# Altium schematic sheet PowerMeasurement.SchDoc
size A
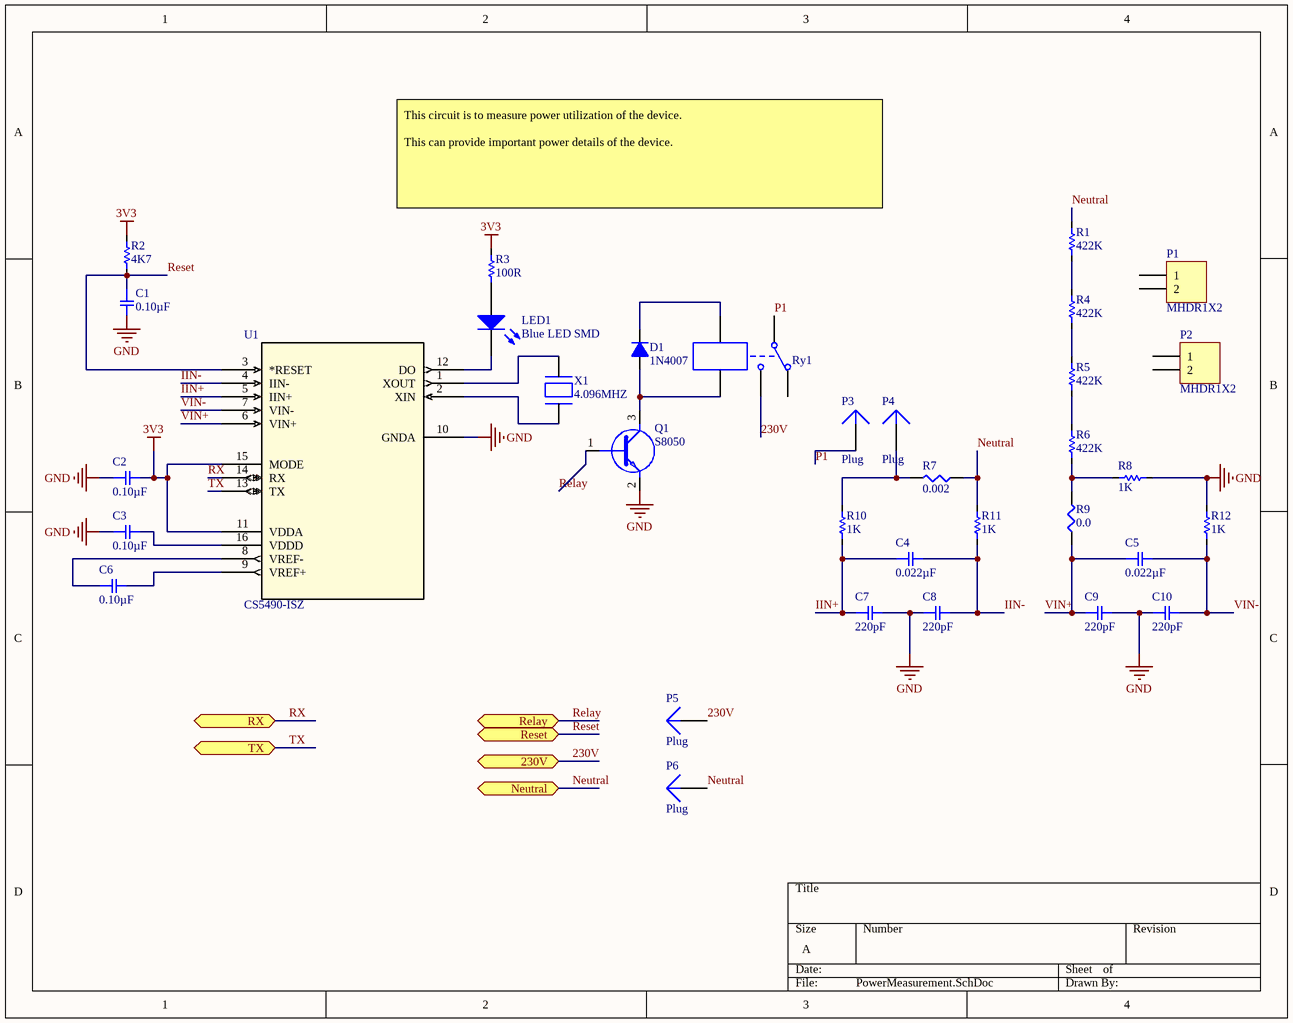
[diagram p0: PowerMeasurement.SchDoc]

## Parts
C1  0.10µF  [SMD-0402C]
C2  0.10µF  [SMD-0402C]
C3  0.10µF  [SMD-0402C]
C4  0.022µF  [SMD-0402C]
C5  0.022µF  [SMD-0402C]
C6  0.10µF  [SMD-0402C]
C7  220pF  [SMD-0402C]
C8  220pF  [SMD-0402C]
C9  220pF  [SMD-0402C]
C10  220pF  [SMD-0402C]
D1  1N4007  [D2A]
LED1  Blue LED SMD  [1206 Blue LED SMD]
P1  MHDR1X2  [MHDR1X2]
P2  MHDR1X2  [MHDR1X2]
P3  Plug  [PIN1]
P4  Plug  [PIN1]
P5  Plug  [PIN1]
P6  Plug  [PIN1]
Q1  S8050  [SI2305TP]
R1  422K  [MCS 0402]
R2  4K7  [MCS 0402]
R3  100R  [MCS 0402]
R4  422K  [MCS 0402]
R5  422K  [MCS 0402]
R6  422K  [MCS 0402]
R7  0.002  [SMD-2512-RES]
R8  1K  [MCS 0402]
R9  0.0  [SMD-0402-RES]
R10  1K  [MCS 0402]
R11  1K  [MCS 0402]
R12  1K  [MCS 0402]
Ry1  Relay  [SRD-05VDC-SL-C]  (value not drawn)
U1  CS5490-ISZ  [CIR-SOIC-16_W150]
X1  4.096MHZ  [XTAL_ABLS2-4.096MHZ-D4Y-T]

## Ports
230V (bidir), Neutral (bidir), Relay (bidir), Reset (bidir), RX (bidir), TX (bidir)

## Nets
3V3: C2.2 R2.2 R3.2 U1.11(VDDA) U1.15(MODE)
GND: C1.2 C2.1 C3.1 C7.2 C8.1 C9.2 C10.1 Q1.2(E) R8.1 R12.2 U1.10(GNDA)
230V: P5.1 Ry1.5 ; port 230V
IIN+: C4.1 C7.1 R10.1 U1.5(IIN+)
IIN-: C4.2 C8.2 R11.1 U1.4(IIN-)
Neutral: P6.1 R1.2 R7.1 R11.2 ; port Neutral
P1: P3.1 Ry1.4
Relay: Q1.1(B) ; port Relay
Reset: C1.1 R2.1 U1.3(*RESET) ; port Reset
RX: U1.14(RX) ; port RX
TX: U1.13(TX) ; port TX
VIN+: C5.1 C9.1 R9.1 U1.6(VIN+)
VIN-: C5.2 C10.2 R12.1 U1.7(VIN-)
NetC3_2: C3.2 U1.16(VDDD)
NetC6_1: C6.1 U1.8(VREF-)
NetC6_2: C6.2 U1.9(VREF+)
NetD1_1: D1.1(A) Q1.3(C) Ry1.2
NetD1_2: D1.2(K) Ry1.1
NetLED1_1: LED1.1(A) R3.1
NetLED1_2: LED1.2(K) U1.12(DO)
NetP4_1: P4.1 R7.2 R10.2
NetR1_1: R1.1 R4.2
NetR4_1: R4.1 R5.2
NetR5_1: R5.1 R6.2
NetR6_1: R6.1 R8.2 R9.2
NetU1_1: U1.1(XOUT) X1.2
NetU1_2: U1.2(XIN) X1.1

Not connected (* = marked no-connect by the designer): P1 1 2; P2 1 2; Ry1 3

## Notes on the sheet
- (near R3) This circuit is to measure power utilization of the device.
  This can provide important power details of the device.

## Library data of the parts
C1-C3 C6 = GCM155R71C104KA55D: CAP CER 0.1UF 16V X7R 0402; Manufacturer: Murata Electronics North America; Factory Stock: 0; Unit Price (USD): 0.1; Minimum Quantity: 1; Tolerance: ±10%; Datasheets: http://www.murata.com/~/media/webrenewal/support/library/catalog/products/capacitor/mlcc/c03e.ashx; Image: //media.digikey.com/Renders/Murata%20Renders/ZRB-SERIES-0402.jpg; Digi-Key Part Number: 490-4759-1-ND; Part Number: GCM155R71C104KA55D; Quantity Available: 734194; @ qty: 0; Packaging: Cut Tape (CT); Series: GCM; Part Status: Active; Value: 0.10µF; Voltage: 16V; Temperature Coefficient: X7R; Operating Temperature: -55°C ~ 125°C; Features: -; Ratings: AEC-Q200; Applications: Automotive; Mounting Type: Surface Mount, MLCC; Package / Case: 0402 (1005 Metric); Size / Dimension: 0.039" L x 0.020" W (1.00mm x 0.50mm); Height - Seated (Max): -; Thickness (Max): 0.022" (0.55mm); Lead Spacing: -; Lead Style: -
C4 C5 = GCM155R71H223KA55D: CAP CER 0.022UF 50V X7R 0402; Manufacturer: Murata Electronics North America; Factory Stock: 0; Unit Price (USD): 0.1; Minimum Quantity: 1; Tolerance: ±10%; Datasheets: http://www.murata.com/~/media/webrenewal/support/library/catalog/products/capacitor/mlcc/c03e.ashx; Image: //media.digikey.com/Renders/Murata%20Renders/ZRB-SERIES-0402.jpg; Digi-Key Part Number: 490-4763-1-ND; Part Number: GCM155R71H223KA55D; Quantity Available: 203538; @ qty: 0; Packaging: Cut Tape (CT); Series: GCM; Part Status: Active; Value: 0.022µF; Voltage: 50V; Temperature Coefficient: X7R; Operating Temperature: -55°C ~ 125°C; Features: -; Ratings: AEC-Q200; Applications: Automotive; Mounting Type: Surface Mount, MLCC; Package / Case: 0402 (1005 Metric); Size / Dimension: 0.039" L x 0.020" W (1.00mm x 0.50mm); Height - Seated (Max): -; Thickness (Max): 0.022" (0.55mm); Lead Spacing: -; Lead Style: -
C7-C10 = GCM1555C1H221JA16D: CAP CER 220PF 50V NP0 0402; Manufacturer: Murata Electronics North America; Factory Stock: 0; Unit Price (USD): 0.1; Minimum Quantity: 1; Tolerance: ±5%; Temperature Coefficient: C0G, NP0; Datasheets: http://www.murata.com/~/media/webrenewal/support/library/catalog/products/capacitor/mlcc/c03e.ashx; Image: //media.digikey.com/Renders/Murata%20Renders/ZRB-SERIES-0402.jpg; Digi-Key Part Number: 490-4927-1-ND; Part Number: GCM1555C1H221JA16D; Quantity Available: 20733; @ qty: 0; Packaging: Cut Tape (CT); Series: GCM; Part Status: Active; Value: 220pF; Voltage: 50V; Operating Temperature: -55°C ~ 125°C; Features: -; Ratings: AEC-Q200; Applications: Automotive; Mounting Type: Surface Mount, MLCC; Package / Case: 0402 (1005 Metric); Size / Dimension: 0.039" L x 0.020" W (1.00mm x 0.50mm); Height - Seated (Max): -; Thickness (Max): 0.022" (0.55mm); Lead Spacing: -; Lead Style: -
D1 = 1N4007: Diode 1A; Value: 1N4007
LED1 = Blue LED SMD: Latest Reviewer: Zion Blue; Category: LED; Mounting Technology: Surface Mount; LatestRevisionNote: Footprint Corrections; LatestRevisionDate: 21-Jun-2014; Publisher: Cynetik Group
P1 P2 = MHDR1X2: Header, 2-Pin; LatestRevisionDate: 17-Jul-2002; LatestRevisionNote: Re-released for DXP Platform.; Publisher: Altium Limited
Q1 = MMSS8050-H-TP: TRANS NPN 25V 1.5A SOT23; Manufacturer: MCC; Vce Saturation (Max) @ Ib, Ic: 500mV @ 80mA, 800mA; Current - Collector Cutoff (Max): 100nA; DC Current Gain (hFE) (Min) @ Ic, Vce: 120 @ 100mA, 1V; Power - Max: 625mW; Frequency - Transition: 100MHz; Online Catalog: NPN Transistors; Other Names: MMSS8050-H-TP-ND MMSS8050-H-TPMSTR MMSS8050HTP Q6289485; Supplier 1: Digi-Key; Manufacturer Part Number: MMSS8050-H-TP; Stock 1: 2136; Pricing 1: 1=0.21, 10=0.19, 25=0.1728, 100=0.1246, 250=0.0734, 500=0.0609, 1000=0.0415 (USD); Standard Package: 3,000; Category: Discrete Semiconductor Products; Family: Transistors (BJT) - Single; Series: -; Packaging: Tape & Reel (TR); Transistor Type: NPN; Current - Collector (Ic) (Max): 1.5A; Voltage - Collector Emitter Breakdown (Max): 25V; Mounting Type: Surface Mount; Package / Case: TO-236-3, SC-59, SOT-23-3; Supplier Device Package: SOT-23; ComponentLink1URL: http://www.mouser.com/ds/2/258/MMSS8050-255048.pdf; ComponentLink1Description: http://www.mouser.com/ds/2/258/MMSS8050-255048.pdf; ComponentLink2URL: http://www.mccsemi.com/up_pdf/MMSS8050(SOT-23).pdf; ComponentLink2Description: http://www.mccsemi.com/up_pdf/MMSS8050(SOT-23).pdf; Supplier Part Number 1: MMSS8050-H-TPMSCT-ND
R1 R4-R6 = 422K: RESISTOR, THICK FILM, 422KOHM, 100mW, ± 1%; Manufacturer: Panasonic; Manufacturer Part Number: ERJ-2RKF4223X; EDA / CAD Models: Download from Accelerated Designs; Power (Watts): 0.1W, 1/10W; Temperature Coefficient: ±100ppm/°C; Online Catalog: ERJ Series; Kits: RSM5L-ND  - RES KIT 100K-1M 1/10W 4850PCS; Other Names: ERJ-2RKF4223 ERJ2RKF4223 P422KLCT; Supplier 1: Digi-Key; Stock 1: 90880; Pricing 1: 1=0.1, 10=0.045, 100=0.0183, 1000=0.0082, 2500=0.0072, 5000=0.0059 (USD); Standard Package: 1; Category: Resistors; Family: Chip Resistor - Surface Mount; Series: ERJ; Packaging: Cut Tape (CT); Resistance (Ohms): 422k; Tolerance: ±1%; Composition: Thick Film; Features: Automotive AEC-Q200; Operating Temperature: -55°C ~ 155°C; Package / Case: 0402 (1005 Metric); Supplier Device Package: 0402; Size / Dimension: 0.039" L x 0.020" W (1.00mm x 0.50mm); Height: 0.016" (0.40mm); Number of Terminations: 2; ComponentLink1URL: http://www.farnell.com/datasheets/1678782.pdf; ComponentLink1Description: http://www.farnell.com/datasheets/1678782.pdf; ComponentLink2URL: http://industrial.panasonic.com/www-data/pdf/AOA0000/AOA0000CE2.pdf; ComponentLink2Description: http://industrial.panasonic.com/www-data/pdf/AOA0000/AOA0000CE2.pdf; ComponentLink3URL: http://www.mouser.com/ds/2/315/AOA0000C283-1093288.pdf; ComponentLink3Description: http://www.mouser.com/ds/2/315/AOA0000C283-1093288.pdf; Supplier Part Number 1: P422KLCT-ND
R2 = 4K7 Res: Panasonic ERA Series Thin Film Surface Mount Resistor 0402 Case 4.7k 0.1% 0.063W 25ppm/C; Manufacturer Part Number: ERA-2AEB472X; Resistance: 4.7 kO; Temp Coefficient: ±25 ppm/°C; Supplier 1: Digi-Key; Manufacturer: Panasonic; Stock 1: 111513; Pricing 1: 1=0.43, 10=0.326, 100=0.137, 1000=0.0756, 2500=0.0709, 5000=0.0652 (USD); Rated Power: 0.063 W; Size Code: 0402; Tolerance (%): ±0.1 %; ComponentLink1URL: https://datasheet.ciiva.com/11811/0900766b80beefcc-11811886.pdf; ComponentLink1Description: https://datasheet.ciiva.com/11811/0900766b80beefcc-11811886.pdf; ComponentLink2URL: https://datasheet.ciiva.com/22640/328837-22640615.pdf; ComponentLink2Description: https://datasheet.ciiva.com/22640/328837-22640615.pdf; ComponentLink3URL: https://datasheet.ciiva.com/24023/aoa0000ce26-197354-24023865.pdf; ComponentLink3Description: https://datasheet.ciiva.com/24023/aoa0000ce26-197354-24023865.pdf; ComponentLink4URL: https://datasheet.ciiva.com/46399/328837-46399002.pdf; ComponentLink4Description: https://datasheet.ciiva.com/46399/328837-46399002.pdf; ComponentLink5URL: https://datasheet.ciiva.com/22743/1776116-22743051.pdf; ComponentLink5Description: https://datasheet.ciiva.com/22743/1776116-22743051.pdf; ComponentLink6URL: https://datasheet.ciiva.com/9117/aoa0000ce26-9117420.pdf; ComponentLink6Description: https://datasheet.ciiva.com/9117/aoa0000ce26-9117420.pdf; ComponentLink7URL: https://datasheet.ciiva.com/16759/70068849-16759180.pdf; ComponentLink7Description: https://datasheet.ciiva.com/16759/70068849-16759180.pdf; ComponentLink8URL: https://datasheet.ciiva.com/9117/aoa0000ce26-9117423.pdf; ComponentLink8Description: https://datasheet.ciiva.com/9117/aoa0000ce26-9117423.pdf; ComponentLink9URL: https://datasheet.ciiva.com/16395/aoa0000ce26-16395247.pdf; ComponentLink9Description: https://datasheet.ciiva.com/16395/aoa0000ce26-16395247.pdf; ComponentLink10URL: https://datasheet.ciiva.com/25723/1776116-25723855.pdf; ComponentLink10Description: https://datasheet.ciiva.com/25723/1776116-25723855.pdf; Supplier Part Number 1: P4.7KDCCT-ND
R3 = 100R: Res Thin Film 0402 100 Ohm 0.5% 0.063W(1/16W) ±25ppm/C Molded SMD Automotive Punched T/R; Manufacturer: Panasonic; Manufacturer Part Number: ERA-2AED101X; Featured Product: ERA-xA Metal/Thin Film Chip Resistors Hot New Technologies Wearables Technology Components; EDA / CAD Models: Download from Accelerated Designs; Resistance (Ohms): 100; Power (Watts): 0.063W, 1/16W; Temperature Coefficient: ±25ppm/°C; Online Catalog: ERA-2A Series; Other Names: P100DEDKR; Supplier 1: Digi-Key; Stock 1: 25171; Pricing 1: 1=0.22, 10=0.188, 100=0.0735, 1000=0.0308, 2500=0.0282, 5000=0.0256 (USD); Standard Package: 1; Category: Resistors; Family: Chip Resistor - Surface Mount; Series: ERA-2A; Packaging: Digi-Reel®; Tolerance: ±0.5%; Composition: Thin Film; Features: Automotive AEC-Q200; Operating Temperature: -55°C ~ 155°C; Package / Case: 0402 (1005 Metric); Supplier Device Package: 0402; Size / Dimension: 0.039" L x 0.020" W (1.00mm x 0.50mm); Height: 0.016" (0.40mm); Number of Terminations: 2; ComponentLink1URL: http://www.mouser.com/ds/2/315/AOA0000C237-1100991.pdf; ComponentLink1Description: http://www.mouser.com/ds/2/315/AOA0000C237-1100991.pdf; ComponentLink2URL: http://www.farnell.com/datasheets/1776116.pdf; ComponentLink2Description: http://www.farnell.com/datasheets/1776116.pdf; ComponentLink3URL: http://industrial.panasonic.com/www-data/pdf/AOA0000/AOA0000CE26.pdf; ComponentLink3Description: http://industrial.panasonic.com/www-data/pdf/AOA0000/AOA0000CE26.pdf; Supplier Part Number 1: P100DECT-ND
R7 = ERJ-MP4PF2M0U: RES SMD 0.002 OHM 1% 2W 2512; Manufacturer: Panasonic Electronic Components; Factory Stock: 0; Unit Price (USD): 0.22038; @ qty: 1500; Minimum Quantity: 1; Temperature Coefficient: ±75ppm/°C; Part Number: ERJ-MP4PF2M0U; Datasheets: https://industrial.panasonic.com/cdbs/www-data/pdf/RDA0000/AOA0000C263.pdf; Image: //media.digikey.com/Photos/Panasonic%20Elect%20Works%20Photos/MFG_ERJ-MS4.jpg; Digi-Key Part Number: P19407CT-ND; Quantity Available: 1991; Packaging: Cut Tape (CT); Series: ERJ; Part Status: Active; Value: 0.002; Tolerance: ±1%; Power (Watts): 2W; Composition: Metal Element; Features: Automotive AEC-Q200, Current Sense, Moisture Resistant; Operating Temperature: -65°C ~ 170°C; Package / Case: 2512 (6432 Metric); Supplier Device Package: 2512; Size / Dimension: 0.252" L x 0.126" W (6.40mm x 3.20mm); Height - Seated (Max): 0.035" (0.89mm); Number of Terminations: 2; Failure Rate: -
R8 R10-R12 = 1K Res: RES SMD 1K OHM 5% 1/32W 01005; Manufacturer: Panasonic; Manufacturer Part Number: ERJ-XGNJ102Y; Resistance: 1 kOhms; Power Rating: 31 mW; Temperature Coefficient: 200 PPM / C; Voltage Rating: 15 V; Case Height: 0.13 mm; Case Length: 0.4 mm; Case Width: 0.2 mm; Supplier 1: Digi-Key; Stock 1: 104433; Pricing 1: 1=0.4, 10=0.335, 100=0.131, 1000=0.0548, 2500=0.0503, 5000=0.0457 (USD); Product Category: Thick Film Resistors - SMD; RoHS: Details; Tolerance: 5 %; Case Code - in: 01005; Case Code - mm: 0402; Operating Temperature Range: - 55 C to + 125 C; Brand: Panasonic; Package / Case: 01005 (0402 metric); Packaging: Reel; Product: Thick Film Resistors SMD; Series: ERJ; Factory Pack Quantity: 20000; Type: Thick Film Resistors SMD; ComponentLink1URL: https://datasheet.ciiva.com/9199/aoa0000ce1-9199077.pdf; ComponentLink1Description: https://datasheet.ciiva.com/9199/aoa0000ce1-9199077.pdf; ComponentLink2URL: https://datasheet.ciiva.com/6544/erjxgn-6544006.pdf; ComponentLink2Description: https://datasheet.ciiva.com/6544/erjxgn-6544006.pdf; ComponentLink3URL: https://datasheet.ciiva.com/17215/aoa0000ce1-17215353.pdf; ComponentLink3Description: https://datasheet.ciiva.com/17215/aoa0000ce1-17215353.pdf; ComponentLink4URL: https://datasheet.ciiva.com/6544/erjxgn-6544011.pdf; ComponentLink4Description: https://datasheet.ciiva.com/6544/erjxgn-6544011.pdf; ComponentLink5URL: https://datasheet.ciiva.com/30174/4aoa0000ce1-30174159.pdf; ComponentLink5Description: https://datasheet.ciiva.com/30174/4aoa0000ce1-30174159.pdf; Supplier Part Number 1: P1.0KAWCT-ND
R9 = ERJ-2GE0R00X: RES SMD 0.0OHM JUMPER 1/10W 0402; Manufacturer: Panasonic Electronic Components; Factory Stock: 0; Unit Price (USD): 0.00384; @ qty: 1500; Minimum Quantity: 1; Power (Watts): 0.1W, 1/10W; Part Number: ERJ-2GE0R00X; Datasheets: http://industrial.panasonic.com/www-cgi/jvcr13pz.cgi?E+PZ+3+AOA0001+ERJ2GE0R00X+7+WW; Image: //media.digikey.com/Photos/Panasonic%20Photos/ERJ-PA2-Series.jpg; Digi-Key Part Number: P0.0JCT-ND; Quantity Available: 3152483; Packaging: Cut Tape (CT); Series: ERJ; Part Status: Active; Value: 0.0; Tolerance: Jumper; Composition: Thick Film; Features: Automotive AEC-Q200; Temperature Coefficient: -; Operating Temperature: -55°C ~ 155°C; Package / Case: 0402 (1005 Metric); Supplier Device Package: 0402; Size / Dimension: 0.039" L x 0.020" W (1.00mm x 0.50mm); Height - Seated (Max): 0.016" (0.40mm); Number of Terminations: 2; Failure Rate: -
Ry1 = SRD-05VDC-SL-C: Songle Relay; LatestReviewer: Evan Green; Published: 02-Apr-2015; LatestRevisionDate: 02-Apr-2015; LatestRevisionNote: Component Created; Publisher: Cynetik Group
U1 = CS5490-ISZ: Imported; Built_By: EMA_UL_Team; Vendor: Cirrus Logic; Manufacturer_Part_Number: CS5490-ISZ; RefDes: RefDes; Type: DEV; Value: Value
X1 = ABLS2-4.096MHZ-D4Y-T: 4.096MHz ±30ppm Crystal 18pF 180 Ohm -40°C ~ 85°C  Surface Mount HC49/US; Manufacturer: Abracon; ESR: 180 ohm; Frequency Stability: ?30 ppm; Frequency Tolerance: ?30; Mode of Oscillation: Fundamental; Product Depth (mm): 4.7 mm; Product Length (mm): 11.4 mm; Screening Level: Industrial; Supplier 1: Digi-Key; Manufacturer Part Number: ABLS2-4.096MHZ-D4Y-T; Stock 1: 6062; Pricing 1: 1=0.46, 10=0.385, 50=0.3466, 100=0.308, 500=0.2926 (USD); Frequency: 4.096 MHz; Load Capacitance: 18 pF; Mounting Style: Surface Mount; Operating Temp Range: -40C to 85C; Package / Case: HC-49/US; Packaging: Tape and Reel; Type: Crystal; ComponentLink1URL: http://www.abracon.com/Resonators/ABLS2.pdf; ComponentLink1Description: http://www.abracon.com/Resonators/ABLS2.pdf; ComponentLink2URL: https://abracon.com/Resonators/ABLS2.pdf; ComponentLink2Description: https://abracon.com/Resonators/ABLS2.pdf; ComponentLink3URL: http://www.farnell.com/datasheets/1749648.pdf; ComponentLink3Description: http://www.farnell.com/datasheets/1749648.pdf; Supplier Part Number 1: 535-9858-1-ND
P3-P6 = Plug: LatestRevisionDate: 17-Jul-2002; LatestRevisionNote: Re-released for DXP Platform.; Publisher: Altium Limited